# Altium project BMRS-PCB.001.01_PUMA_Motor_Driver.PrjPcb
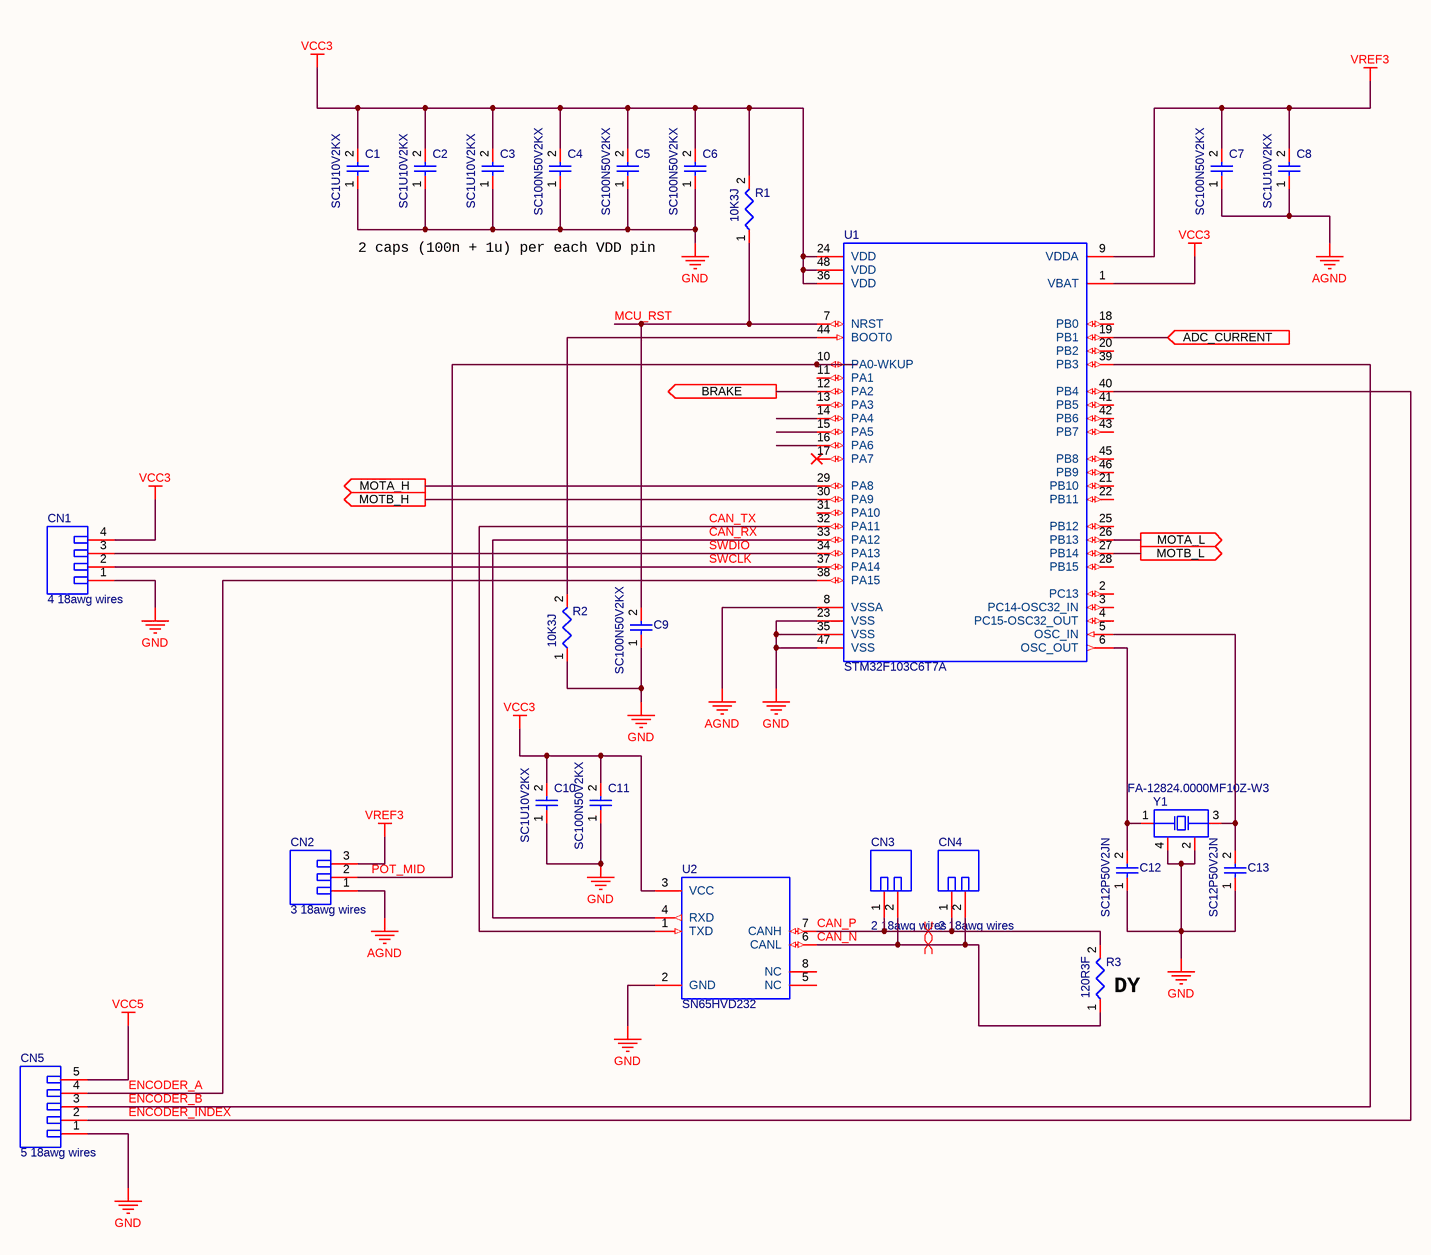
[diagram p0: 1_MCU.SchDoc]
3 sheets, 82 parts. Net scope: flat (ports and power ports of the same name join across sheets).
Board file: PM-1_motorDriverModule.PcbDoc
Sheets:
  1_MCU.SchDoc
  2_Power.SchDoc
  3_MotorDriver.SchDoc

## Sheet 1_MCU.SchDoc: Untitled
size A3; CompanyName: Tsuru Robotics; Organization: Tsuru Robotics; Revision: -1

### Parts
C1  SC1U10V2KX  [CAPC0402(1005)60_L]
C2  SC1U10V2KX  [CAPC0402(1005)60_L]
C3  SC1U10V2KX  [CAPC0402(1005)60_L]
C4  SC100N50V2KX  [CAPC0402(1005)60_L]
C5  SC100N50V2KX  [CAPC0402(1005)60_L]
C6  SC100N50V2KX  [CAPC0402(1005)60_L]
C7  SC100N50V2KX  [CAPC0402(1005)60_L]
C8  SC1U10V2KX  [CAPC0402(1005)60_L]
C9  SC100N50V2KX  [CAPC0402(1005)60_L]
C10  SC1U10V2KX  [CAPC0402(1005)60_L]
C11  SC100N50V2KX  [CAPC0402(1005)60_L]
C12  SC12P50V2JN  [CAPC0402(1005)33_L]
C13  SC12P50V2JN  [CAPC0402(1005)33_L]
CN1  4 18awg wires  [4PHEADERS-2D54]  (no BOM)
CN2  3 18awg wires  [3PHEADERS-2D54]  (no BOM)
CN3  2 18awg wires  [2PHEADERS-2D54]  (no BOM)
CN4  2 18awg wires  [2PHEADERS-2D54]  (no BOM)
CN5  5 18awg wires  [5PHEADERS-2D54]  (no BOM)
R1  10K3J  [RESC0603(1608)_L]
R2  10K3J  [RESC0603(1608)_L]
R3  120R3F  [RESC0603(1608)_L]
U1  STM32F103C6T7A  [TSQFP50P900X900X160-48L]
U2  SN65HVD232  [SOIC127P600X175-8L]
Y1  FA-12824.0000MF10Z-W3  [QRTZ-12mhz]

### Ports
ADC_CURRENT (in), BRAKE (out), MOTA_H (out), MOTA_L (out), MOTB_H (out), MOTB_L (out)

### Nets
AGND: C7.1 C8.1 CN2.1 U1.8(VSSA)
GND: C1.1 C2.1 C3.1 C4.1 C5.1 C6.1 C9.1 C10.1 C11.1 C12.1 C13.1 CN1.1 CN5.1 R2.1 U1.23(VSS) U1.35(VSS) U1.47(VSS) U2.2(GND) Y1.2(NC) Y1.4(NC)
VCC3: C1.2 C2.2 C3.2 C4.2 C5.2 C6.2 C10.2 C11.2 CN1.4 R1.2 U1.1(VBAT) U1.24(VDD) U1.36(VDD) U1.48(VDD) U2.3(VCC)
VCC5: CN5.5
VREF3: C7.2 C8.2 CN2.3 U1.9(VDDA)
A_CURRENT: U1.19(PB1) ; port ADC_CURRENT
BRAKE: U1.12(PA2) ; port BRAKE
CAN_N: CN3.2 CN4.2 R3.1 U2.6(CANL)
CAN_P: CN3.1 CN4.1 R3.2 U2.7(CANH)
CAN_RX: U1.33(PA12) U2.4(RXD)
CAN_TX: U1.32(PA11) U2.1(TXD)
ENCODER_A: CN5.4 U1.38(PA15)
ENCODER_B: CN5.3 U1.39(PB3)
ENCODER_INDEX: CN5.2 U1.40(PB4)
MCU_RST: C9.2 R1.1 U1.7(NRST)
MOTA_H: U1.29(PA8) ; port MOTA_H
MOTA_L: U1.26(PB13) ; port MOTA_L
MOTB_H: U1.30(PA9) ; port MOTB_H
MOTB_L: U1.27(PB14) ; port MOTB_L
POT_MID: CN2.2 U1.10(PA0-WKUP)
SWCLK: CN1.2 U1.37(PA14)
SWDIO: CN1.3 U1.34(PA13)
NetC12_2: C12.2 U1.6(OSC_OUT) Y1.1(X1)
NetC13_2: C13.2 U1.5(OSC_IN) Y1.3(X2)
NetR2_2: R2.2 U1.44(BOOT0)

Not connected (* = marked no-connect by the designer): U1 2(PC13) 3(PC14-OSC32_IN) 4(PC15-OSC32_OUT) 11(PA1) 13(PA3) 14(PA4) 15(PA5) 16(PA6) 17(PA7)* 18(PB0) 20(PB2) 21(PB10) 22(PB11) 25(PB12) 28(PB15) 31(PA10) 41(PB5) 42(PB6) 43(PB7) 45(PB8) 46(PB9); U2 5(NC) 8(NC)

### Layout directives
differential pair: CAN_P
differential pair; differential pair class *: CAN_N

### Notes on the sheet
- 2 caps (100n + 1u) per each VDD pin
- (near R3) DY
- Title
- Size:
- Date:
- A3
- Number:
- Time:
- Revision:
- Sheet
- of
- File:

### Library data of the parts
C1-C3 C8 C10 = CAP(0402)1UF10V: CAP 1uF 10V ±10% 0402 (1005 Metric) Thickness 0.6mm SMD
C4-C7 C9 C11 = CAP(0402)100nF50V: CAP 100nF 50V ±10% 0402 (1005 Metric) Thickness 0.6mm SMD
C12 C13 = CAP12pF: CAP 12pF 50V ±5% 0402 (1005 Metric) Thickness 0.33mm SMD
CN1 = 4PIN-CN: 4 holes for 18awg wire; Manufacturer: JST; Datasheet URL: http://www.jst-mfg.com/product/pdf/eng/eGH.pdf; Package Reference: JST-BM04B-GHS-TBT
CN2 = 3PIN-CN: 3 holes for 18awg wire; Manufacturer: JST; Datasheet URL: http://www.jst-mfg.com/product/pdf/eng/eGH.pdf; Package Reference: JST-BM04B-GHS-TBT
CN3 CN4 = 2PIN-CN: 2 holes for 18awg wire; Manufacturer: JST; Datasheet URL: http://www.jst-mfg.com/product/pdf/eng/eGH.pdf; Package Reference: JST-BM04B-GHS-TBT
CN5 = 5PIN-CN: 5 holes for 18awg wire; Manufacturer: JST; Datasheet URL: http://www.jst-mfg.com/product/pdf/eng/eGH.pdf; Package Reference: JST-BM04B-GHS-TBT
R1 R2 = RES0(0603)_10K: 10K 0.1W 5% 0603 (1608 Metric)  SMD
R3 = RES0(0603)_120R: 100R 0.1W 1% 0603 (1608 Metric)  SMD
U1 = STM32F103C6T7A: ARM® Cortex®-M3 STM32F1 Microcontroller IC 32-Bit 72MHz 32KB 48-LFQP (7x7); Supply Voltage(Vcc) min (V): 2; FLASH Size (Prog) (kB): 512; Operating Frequency(F) (Processor speed) (MHz): 80; Internal RAM Size (kB): 160; Packing: Tape and Reel; Core: ARM Cortex-M4; I/Os: 38; Case/Package: UFQFN-48; RoHS Compliant: Yes; Mounting Technology: Surface Mount; ComponentLink1Description: Manufacturer URL; ComponentLink1URL: http://www.st.com/; Package Reference: UFQFPN48; ComponentLink2Description: Datasheet; ComponentLink2URL: http://www.st.com/st-web-ui/static/active/en/resource/technical/document/datasheet/CD00161566.pdf; Package Description: 48-Pin Ultra Thin Fine Pitch Quad Flat No-Lead, 7 x 7 x 0.6 mm Body, 0.5 mm Pitch, Exposed Pad
U2 = CAN_SN65HVD232D: IC CAN TRANSCEIVER 8-SOIC
Y1 = XTAL-1-3-4: Crystal, 24 MHz, +/- 10 ppm, -20 to 75 degC, 4-Pin SMD, RoHS, Tape and Reel; Frequency Tolerance: 10ppm; Load Capacitance: 12pF; Frequency: 24MHz; ESR (Equivalent Series Resistance): 80R; Length: 0.079inch; Frequency Stability: 10ppm; Width: 0.063inch; Mounting Technology: SMT; Tolerance: 10ppm; RoHS Compliant: Yes; Termination: SMD/SMT; Number of Pins: 4; Package Quantity: 250; Max Operating Temperature: 75°C; Packaging: Tape and Reel; Radiation Hardening: No; Mount: Surface Mount; Lead Free: Lead Free; Case/Package: SMD/SMT; Height: 0.02inch; Min Operating Temperature: -20°C

## Sheet 2_Power.SchDoc
size A3; Organization: Altium Limited; Address1: L3, 12a Rodborough Rd; Address2: Frenchs Forest; Address3: NSW; Address4: Australia 2086
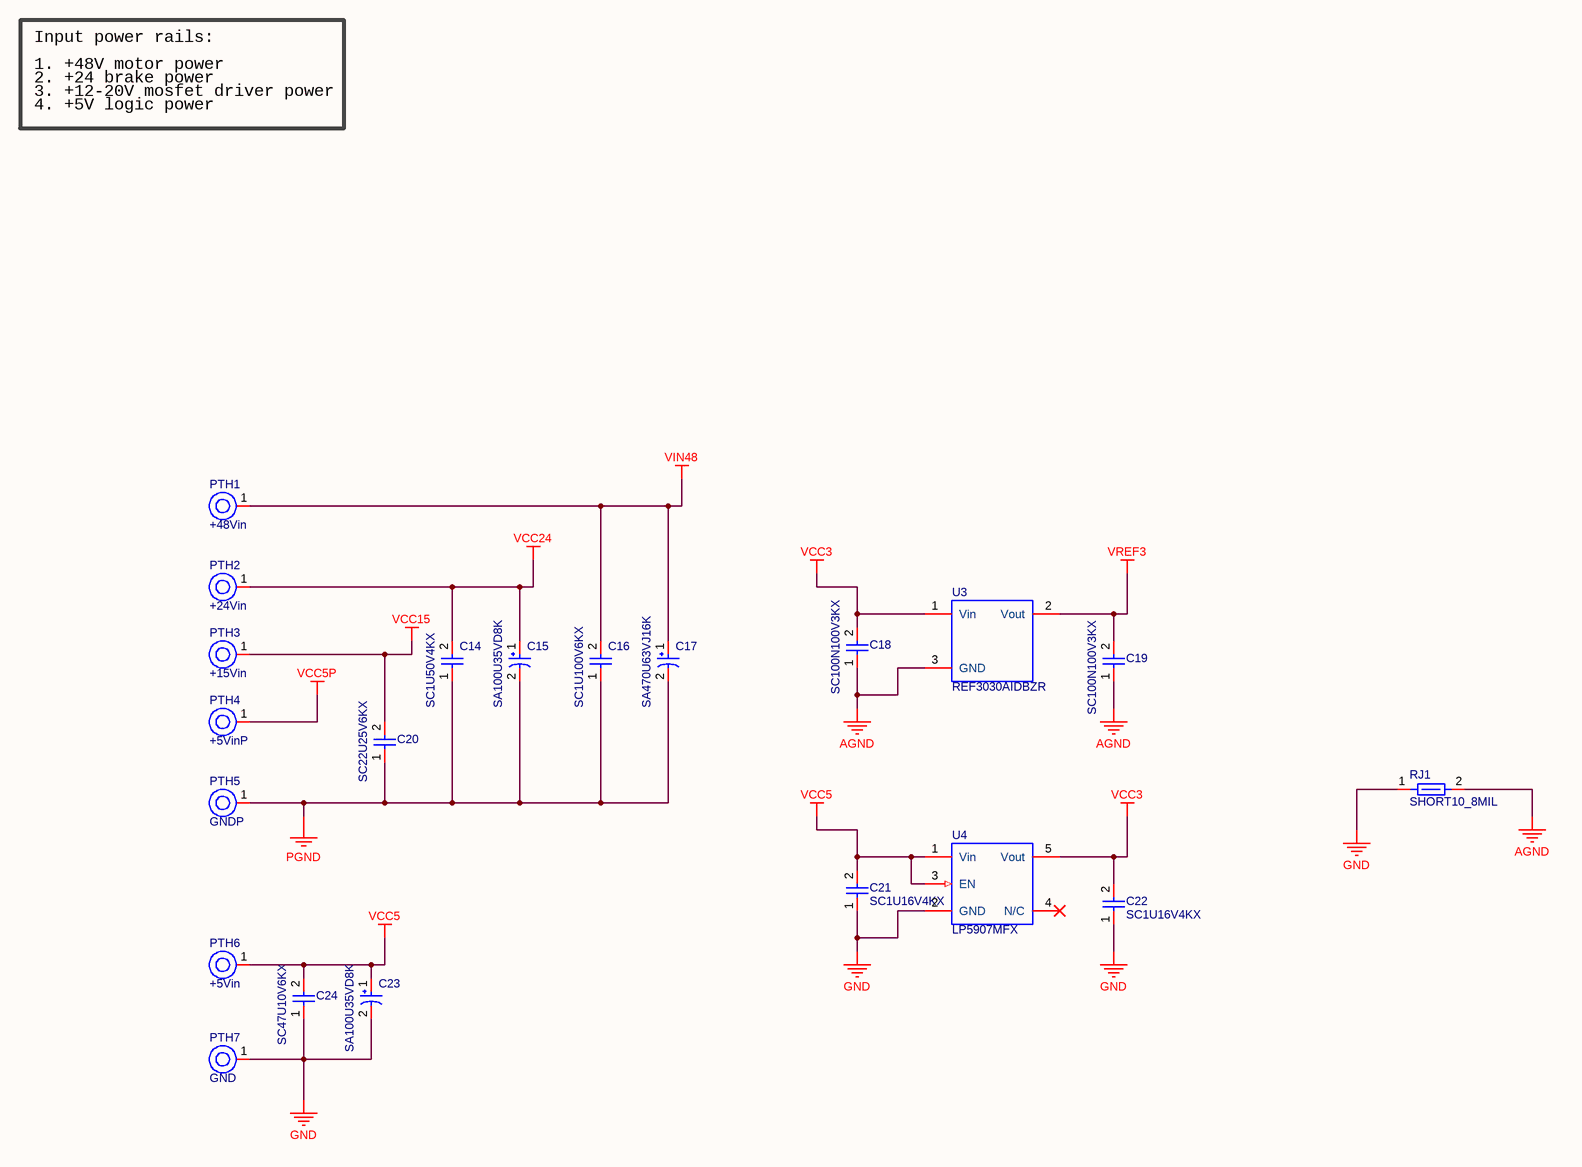
[diagram p1: 2_Power.SchDoc]

### Parts
C14  SC1U50V4KX  [CAPC0805(2012)145_L]
C15  SA100U35VD8K  [CAPAE(D8)7666X80L]
C16  SC1U100V6KX  [CAPC1206(3216)]
C17  SA470U63VJ16K  [CAPAE184170X170L]
C18  SC100N100V3KX  [CAPC0603(1608)100_L]
C19  SC100N100V3KX  [CAPC0603(1608)100_L]
C20  SC22U25V6KX  [CAPC1206(3216)]
C21  SC1U16V4KX  [CAPC0805(2012)145_L]
C22  SC1U16V4KX  [CAPC0805(2012)145_L]
C23  SA100U35VD8K  [CAPAE(D8)7666X80L]
C24  SC47U10V6KX  [CAPC1206(3216)]
PTH1  +48Vin  [POWERHOLE]  (no BOM)
PTH2  +24Vin  [POWERHOLE]  (no BOM)
PTH3  +15Vin  [POWERHOLE-LP]  (no BOM)
PTH4  +5VinP  [POWERHOLE-LP]  (no BOM)
PTH5  GNDP  [POWERHOLE]  (no BOM)
PTH6  +5Vin  [POWERHOLE-LP]  (no BOM)
PTH7  GND  [POWERHOLE-LP]  (no BOM)
RJ1  SHORT10_8MIL  [SHORT10_8MIL-FP]  (net tie, no BOM)
U3  REF3030AIDBZR  [SOT95P237X112-3L]
U4  LP5907MFX  [SOT95P280X145-5L]

### Nets
AGND: C18.1 C19.1 RJ1.2 U3.3(GND)
GND: C21.1 C22.1 C23.2 C24.1 PTH7.1(H1) RJ1.1 U4.2(GND)
PGND: C14.1 C15.2 C16.1 C17.2 C20.1 PTH5.1(H1)
VCC3: C18.2 C22.2 U3.1(Vin) U4.5(Vout)
VCC5: C21.2 C23.1 C24.2 PTH6.1(H1) U4.1(Vin) U4.3(EN)
VCC5P: PTH4.1(H1)
VCC15: C20.2 PTH3.1(H1)
VCC24: C14.2 C15.1 PTH2.1(H1)
VIN48: C16.2 C17.1 PTH1.1(H1)
VREF3: C19.2 U3.2(Vout)

Not connected (* = marked no-connect by the designer): U4 4(N/C)*

### Notes on the sheet
- Input power rails:
- 1. +48V motor power
- 2. +24 brake power
- 3. +12-20V mosfet driver power
- 4. +5V logic power
- Title
- Size:
- Date:
- A3
- Number:
- Time:
- Revision:
- Sheet
- of
- File:

### Library data of the parts
C14 = CAP(0805)1UF50V: CAP 1uF 50V ±10% 0805(1610 Metric) Thickness 1.2mm SMD
C15 C23 = CAP(D8)100UF35V: CAP 100uF 35V ±10% D8 Thickness 7.7mm SMD
C16 = CAP(1206)1UF100V: CAP 1uF 100V ±10% 1206(3216 Metric) Thickness 1.8mm SMD
C17 = CAP(J16)470UF63V: EEVFK1J471M CAP 470uF 63V ±10% J16 Thickness 17mm SMD
C18 C19 = CAP(0603)100nF100V: CAP 100nF 100V ±10% 0603(1608 Metric) Thickness 1mm SMD
C20 = CAP(1206)22UF25V: CAP 22uF 25V ±10% 1206(3216 Metric) Thickness 1.8mm SMD
C21 C22 = CAP(0805)1UF16V: CAP 1uF 16V ±10% 0805(1610 Metric) Thickness 0.6mm SMD
C24 = CAP(1206)47UF10V: CAP 47uF 10V ±10% 1206(3216 Metric) Thickness 1.6mm SMD
PTH1 PTH2 PTH5 = PTH-2M: 2mm hole 3.5mm pad; Pad diameter (mm): 5; Hole diameter (mm): 2.5
PTH3 PTH4 PTH6 PTH7 = PTH-1D2M: 1.2mm hole 2mm pad; Pad diameter (mm): 5; Hole diameter (mm): 2.5
RJ1 = SHORT*: Net tie (10x8mil); Resistance: 0; Tolerance: 5%; Value: 0; Pins: 2; Case/Package: 10x8mil; Mounting Technology: SMT
U3 = REF-REF3030: 3V 25mA 0.2%
U4 = LP5907V3.3: 3.3V 250mA

## Sheet 3_MotorDriver.SchDoc
size A3; Organization: Altium Limited; Address1: L3, 12a Rodborough Rd; Address2: Frenchs Forest; Address3: NSW; Address4: Australia 2086
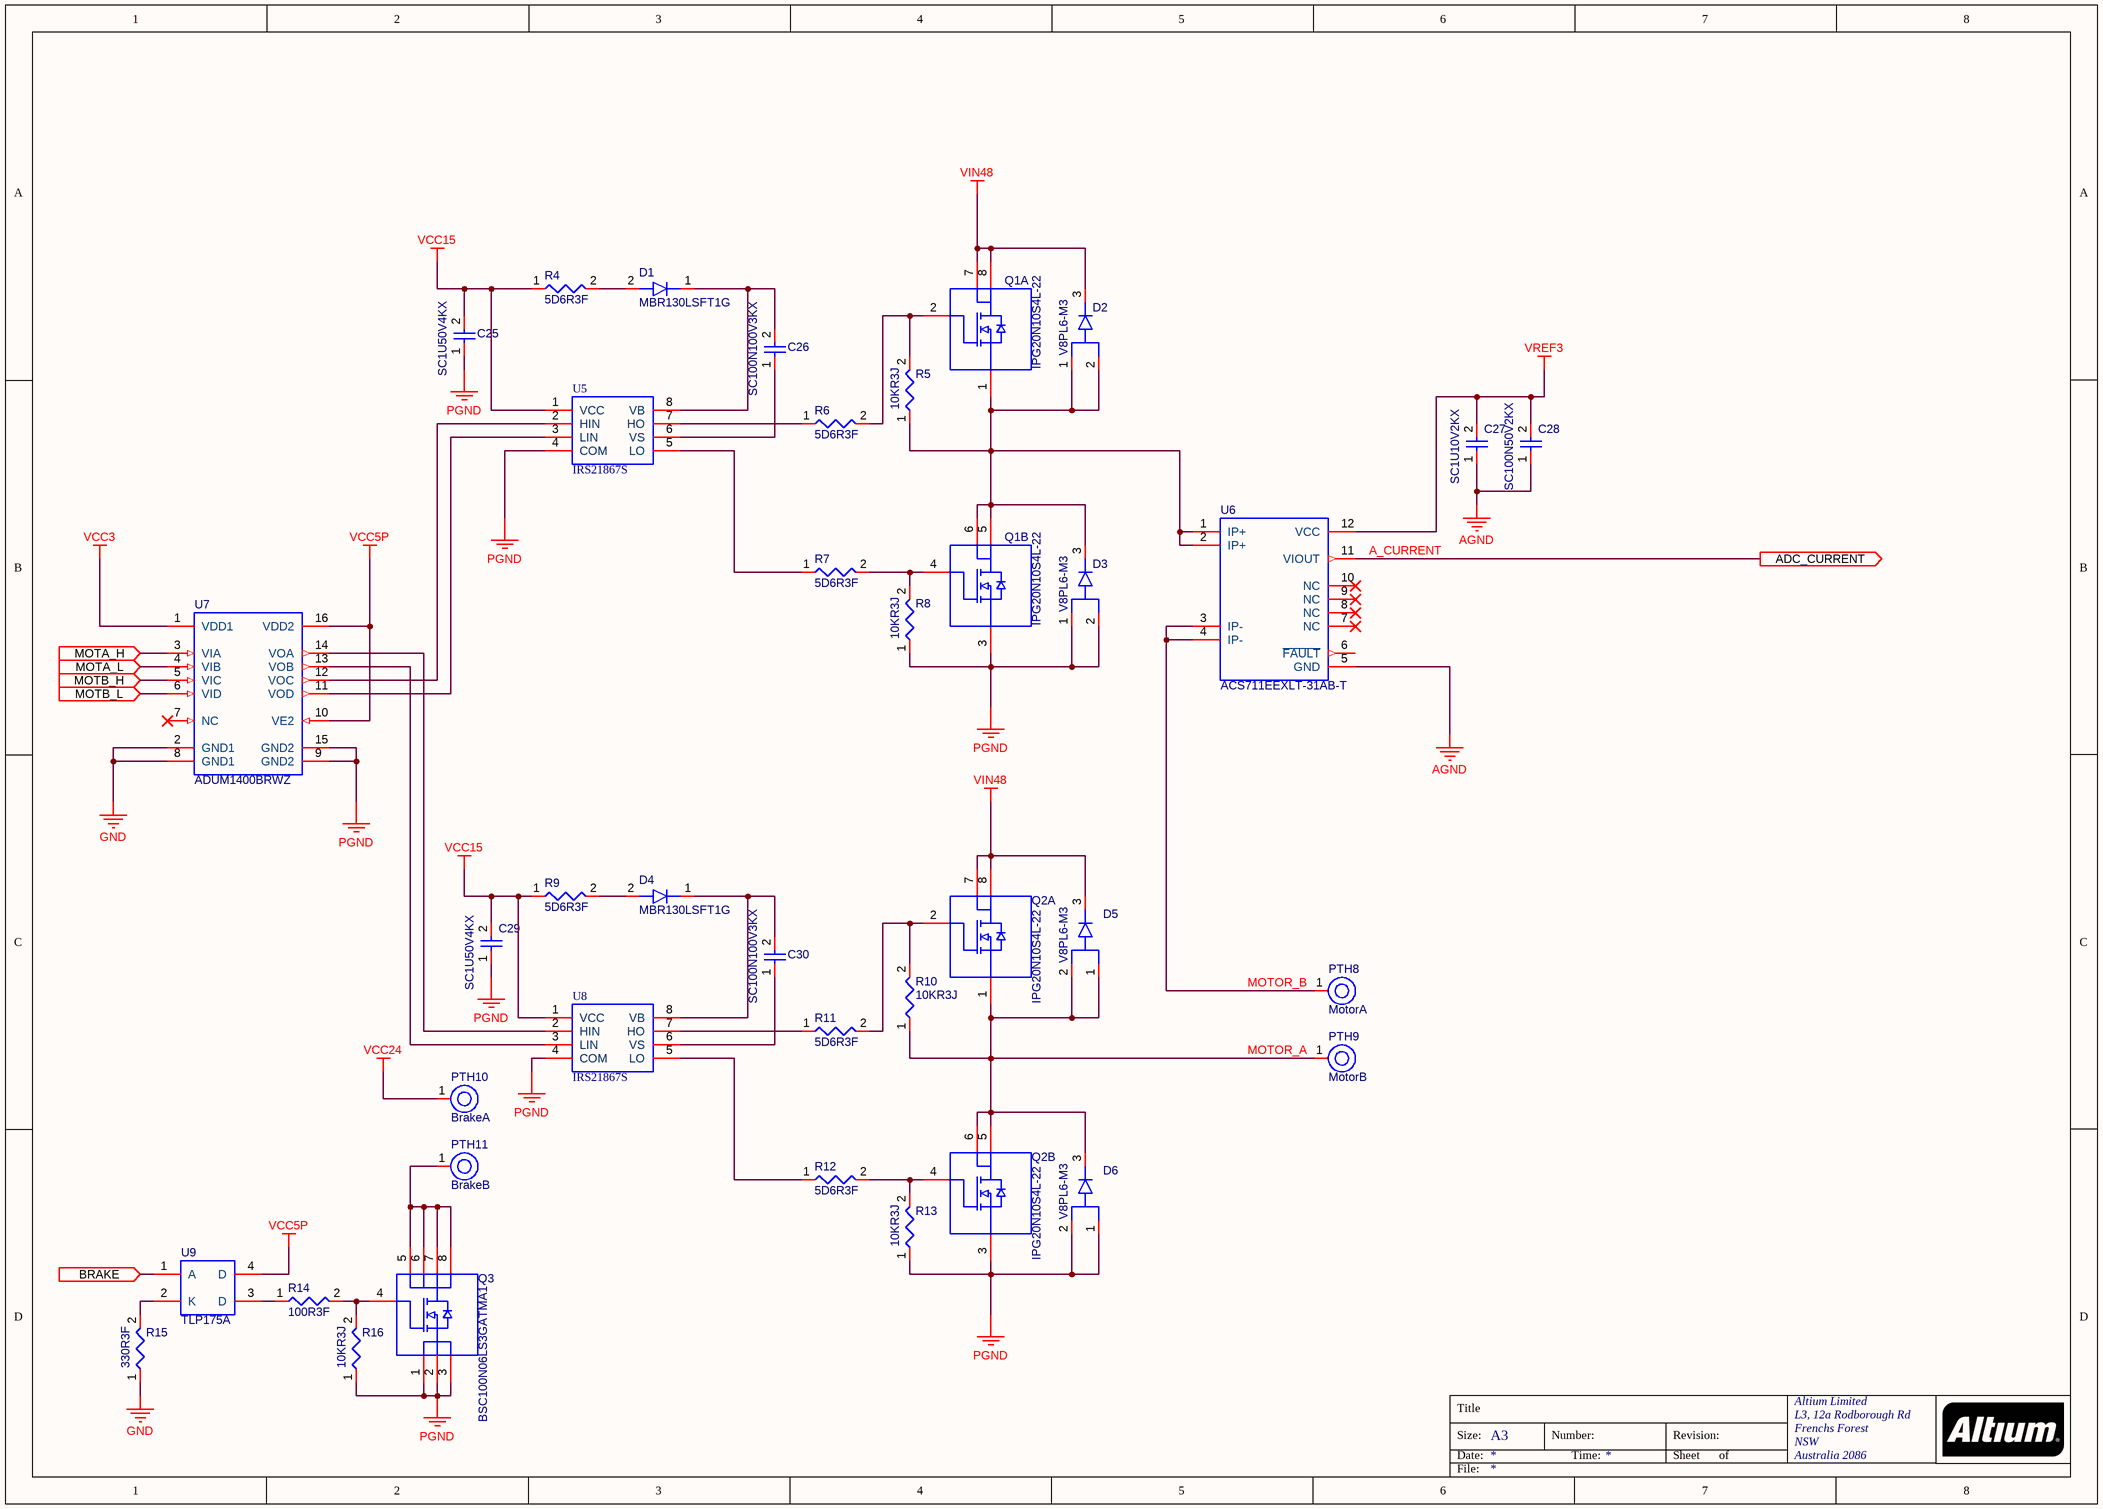
[diagram p2: 3_MotorDriver.SchDoc]

### Parts
C25  SC1U50V4KX  [CAPC0805(2012)145_L]
C26  SC100N100V3KX  [CAPC0603(1608)100_L]
C27  SC1U10V2KX  [CAPC0402(1005)60_L]
C28  SC100N50V2KX  [CAPC0402(1005)60_L]
C29  SC1U50V4KX  [CAPC0805(2012)145_L]
C30  SC100N100V3KX  [CAPC0603(1608)100_L]
D1  MBR130LSFT1G  [SOD-123LF]
D2  V8PL6-M3  [DFN442P610X120-3L]
D3  V8PL6-M3  [DFN442P610X120-3L]
D4  MBR130LSFT1G  [SOD-123LF]
D5  V8PL6-M3  [DFN442P610X120-3L]
D6  V8PL6-M3  [DFN442P610X120-3L]
PTH8  MotorA  [POWERHOLE-LP]  (no BOM)
PTH9  MotorB  [POWERHOLE-LP]  (no BOM)
PTH10  BrakeA  [POWERHOLE-LP]  (no BOM)
PTH11  BrakeB  [POWERHOLE-LP]  (no BOM)
Q1  IPG20N10S4L-22  [PG-TDSON-8-4]  (parts A,B of 2)
Q2  IPG20N10S4L-22  [PG-TDSON-8-4]  (parts A,B of 2)
Q3  BSC100N06LS3GATMA1  [PG-TDSON-8-1]
R4  5D6R3F  [RESC0603(1608)_L]
R5  10KR3J  [RESC0603(1608)_L]
R6  5D6R3F  [RESC0603(1608)_L]
R7  5D6R3F  [RESC0603(1608)_L]
R8  10KR3J  [RESC0603(1608)_L]
R9  5D6R3F  [RESC0603(1608)_L]
R10  10KR3J  [RESC0603(1608)_L]
R11  5D6R3F  [RESC0603(1608)_L]
R12  5D6R3F  [RESC0603(1608)_L]
R13  10KR3J  [RESC0603(1608)_L]
R14  100R3F  [RESC0603(1608)_L]
R15  330R3F  [RESC0603(1608)_L]
R16  10KR3J  [RESC0603(1608)_L]
U5  IRS21867S  [SOIC127P600X175-8L]
U6  ACS711EEXLT-31AB-T  [ACS711EX]
U7  ADUM1400BRWZ  [SOIC127P1030X265-16L]
U8  IRS21867S  [SOIC127P600X175-8L]
U9  TLP175A  [SOP254P700X220-4L]

### Ports
ADC_CURRENT (out), BRAKE (in), MOTA_H (in), MOTA_L (in), MOTB_H (in), MOTB_L (in)

### Nets
AGND: C27.1 C28.1 U6.5(GND)
GND: R15.1 U7.2(GND1) U7.8(GND1)
PGND: C25.1 C29.1 D3.1(A1) D3.2(A2) D6.1(A1) D6.2(A2) Q1.3 Q2.3 Q3.1 Q3.2 Q3.3 R8.1 R13.1 R16.1 U5.4(COM) U7.9(GND2) U7.15(GND2) U8.4(COM)
VCC3: U7.1(VDD1)
VCC5P: U7.10(VE2) U7.16(VDD2) U9.4(D)
VCC15: C25.2 C29.2 R4.1 R9.1 U5.1(VCC) U8.1(VCC)
VCC24: PTH10.1(H1)
VIN48: D2.3(K) D5.3(K) Q1.7 Q1.8 Q2.7 Q2.8
VREF3: C27.2 C28.2 U6.12(VCC)
A_CURRENT: U6.11(VIOUT) ; port ADC_CURRENT
BRAKE: U9.1(A) ; port BRAKE
MOTA_H: U7.3(VIA) ; port MOTA_H
MOTA_L: U7.4(VIB) ; port MOTA_L
MOTB_H: U7.5(VIC) ; port MOTB_H
MOTB_L: U7.6(VID) ; port MOTB_L
MOTOR_A: D5.1(A1) D5.2(A2) D6.3(K) PTH9.1(H1) Q2.1 Q2.5 Q2.6 R10.1
MOTOR_B: PTH8.1(H1) U6.3(IP-) U6.4(IP-)
NetC26_1: C26.1 U5.6(VS)
NetC26_2: C26.2 D1.1(K) U5.8(VB)
NetC30_1: C30.1 U8.6(VS)
NetC30_2: C30.2 D4.1(K) U8.8(VB)
NetD1_2: D1.2(A) R4.2
NetD2_1: D2.1(A1) D2.2(A2) D3.3(K) Q1.1 Q1.5 Q1.6 R5.1 U6.1(IP+) U6.2(IP+)
NetD4_2: D4.2(A) R9.2
NetPTH11_1: PTH11.1(H1) Q3.5 Q3.6 Q3.7 Q3.8
NetQ1_2: Q1.2 R5.2 R6.2
NetQ1_4: Q1.4 R7.2 R8.2
NetQ2_2: Q2.2 R10.2 R11.2
NetQ2_4: Q2.4 R12.2 R13.2
NetQ3_4: Q3.4 R14.2 R16.2
NetR6_1: R6.1 U5.7(HO)
NetR7_1: R7.1 U5.5(LO)
NetR11_1: R11.1 U8.7(HO)
NetR12_1: R12.1 U8.5(LO)
NetR14_1: R14.1 U9.3(D)
NetR15_2: R15.2 U9.2(K)
NetU5_2: U5.2(HIN) U7.12(VOC)
NetU5_3: U5.3(LIN) U7.11(VOD)
NetU7_13: U7.13(VOB) U8.3(LIN)
NetU7_14: U7.14(VOA) U8.2(HIN)

Not connected (* = marked no-connect by the designer): U6 6(~{FAULT}) 7(NC)* 8(NC)* 9(NC)* 10(NC)*; U7 7(NC)*

### Notes on the sheet
- Title
- Size:
- Date:
- A3
- Number:
- Time:
- Revision:
- Sheet
- of
- File:

### Library data of the parts
C25 C29 = CAP(0805)1UF50V: as C14 on sheet 2_Power
C26 C30 = CAP(0603)100nF100V: as C18 on sheet 2_Power
C27 = CAP(0402)1UF10V: as C1 on sheet 1_MCU
C28 = CAP(0402)100nF50V: as C4 on sheet 1_MCU
D1 D4 = DIOD-MBR130: 1А 30В [SOD-123FL] / , RoHS, Tape and Reel; Manufacturer: Rohm; Package Reference: ROHM-1SS400CSFH; Datasheet URL: https://www.rohm.com/datasheet/1SS400CSFH/1ss400csfht2ra-e
D2 D3 D5 D6 = VISH-V8PL6-M3: High Current Density Surface Mount / Trench MOS Barrier Schottky Rectifier / Ultra Low VF = 0.34 V at IF = 4 A; Packing: Tape and Reel; IF Max (A): 0.1; trr Max (ns): 4; Configuration: Single; PackageDescription: 3-Pin Small Outline Transistor, Body 1.2 x 0.8 mm, Pitch 0.4 mm; Mounting Technology: Surface Mount; RoHS: TRUE; PackageVersion: Rev. D, 08/2009; ComponentLink2URL: http://www.onsemi.cn/pub_link/Collateral/DAN222M3-D.PDF; ComponentLink3URL: http://www.onsemi.com/pub_link/Collateral/631AA.PDF; ComponentLink3Description: Package Specification; DatasheetVersion: Rev. 6; PackageReference: SOT-723-3-631AA-01; ComponentLink1URL: http://www.onsemi.com/; ComponentLink1Description: Manufacturer URL; ComponentLink2Description: Datasheet
PTH8-PTH11 = PTH-1D2M: as PTH3 on sheet 2_Power
Q1 Q2 = INF_IPG20N06S4L-26: OptiMOS™-T2 Power-Transistor V DS 100 V / R DS(on) max 22 / ID 20 A
Q3 = NEMOS-BSC100N06L: 100 V N-Channel NexFET™ Power MOSFETs
R4 R6 R7 R9 R11 R12 = RES0(0603)_5R6: 5.6R 0.1W 1% 0603 (1608 Metric)  SMD
R5 R8 R10 R13 R16 = RES0(0603)_10K: 10K 0.1W 5% 0603 (1608 Metric)  SMD
R14 = RES0(0603)_100R: 100R 0.1W 1% 0603 (1608 Metric)  SMD
R15 = RES0(0603)_330R: 330R 0.1W 1% 0603 (1608 Metric)  SMD
U5 U8 = MOSDRV_IRS21867S
U6 = ACS711EX: High Accuracy, Hall-Effect Based Current Sensor / IC in High Isolation QFN Package
U7 = ISOL-ADUM1400: ISOLATOR 4ch in
U9 = OPTO-TLP175A

## Nets that join several sheets
AGND: 1_MCU (C7.1 C8.1 CN2.1 U1.8), 2_Power (C18.1 C19.1 RJ1.2 U3.3), 3_MotorDriver (C27.1 C28.1 U6.5)
GND: 1_MCU (20 pins), 2_Power (7 pins), 3_MotorDriver (R15.1 U7.2 U7.8)
PGND: 2_Power (6 pins), 3_MotorDriver (18 pins)
VCC3: 1_MCU (15 pins), 2_Power (C18.2 C22.2 U3.1 U4.5), 3_MotorDriver (U7.1)
VCC5: 1_MCU (CN5.5), 2_Power (6 pins)
VCC5P: 2_Power (PTH4.1), 3_MotorDriver (U7.10 U7.16 U9.4)
VCC15: 2_Power (C20.2 PTH3.1), 3_MotorDriver (6 pins)
VCC24: 2_Power (C14.2 C15.1 PTH2.1), 3_MotorDriver (PTH10.1)
VIN48: 2_Power (C16.2 C17.1 PTH1.1), 3_MotorDriver (6 pins)
VREF3: 1_MCU (C7.2 C8.2 CN2.3 U1.9), 2_Power (C19.2 U3.2), 3_MotorDriver (C27.2 C28.2 U6.12)
A_CURRENT: 1_MCU (U1.19), 3_MotorDriver (U6.11)
BRAKE: 1_MCU (U1.12), 3_MotorDriver (U9.1)
MOTA_H: 1_MCU (U1.29), 3_MotorDriver (U7.3)
MOTA_L: 1_MCU (U1.26), 3_MotorDriver (U7.4)
MOTB_H: 1_MCU (U1.30), 3_MotorDriver (U7.5)
MOTB_L: 1_MCU (U1.27), 3_MotorDriver (U7.6)